# EAGLE design ESP32-S3 Parallel TFT with Touch 4.3“ V3.1 (EAGLE 6.1)
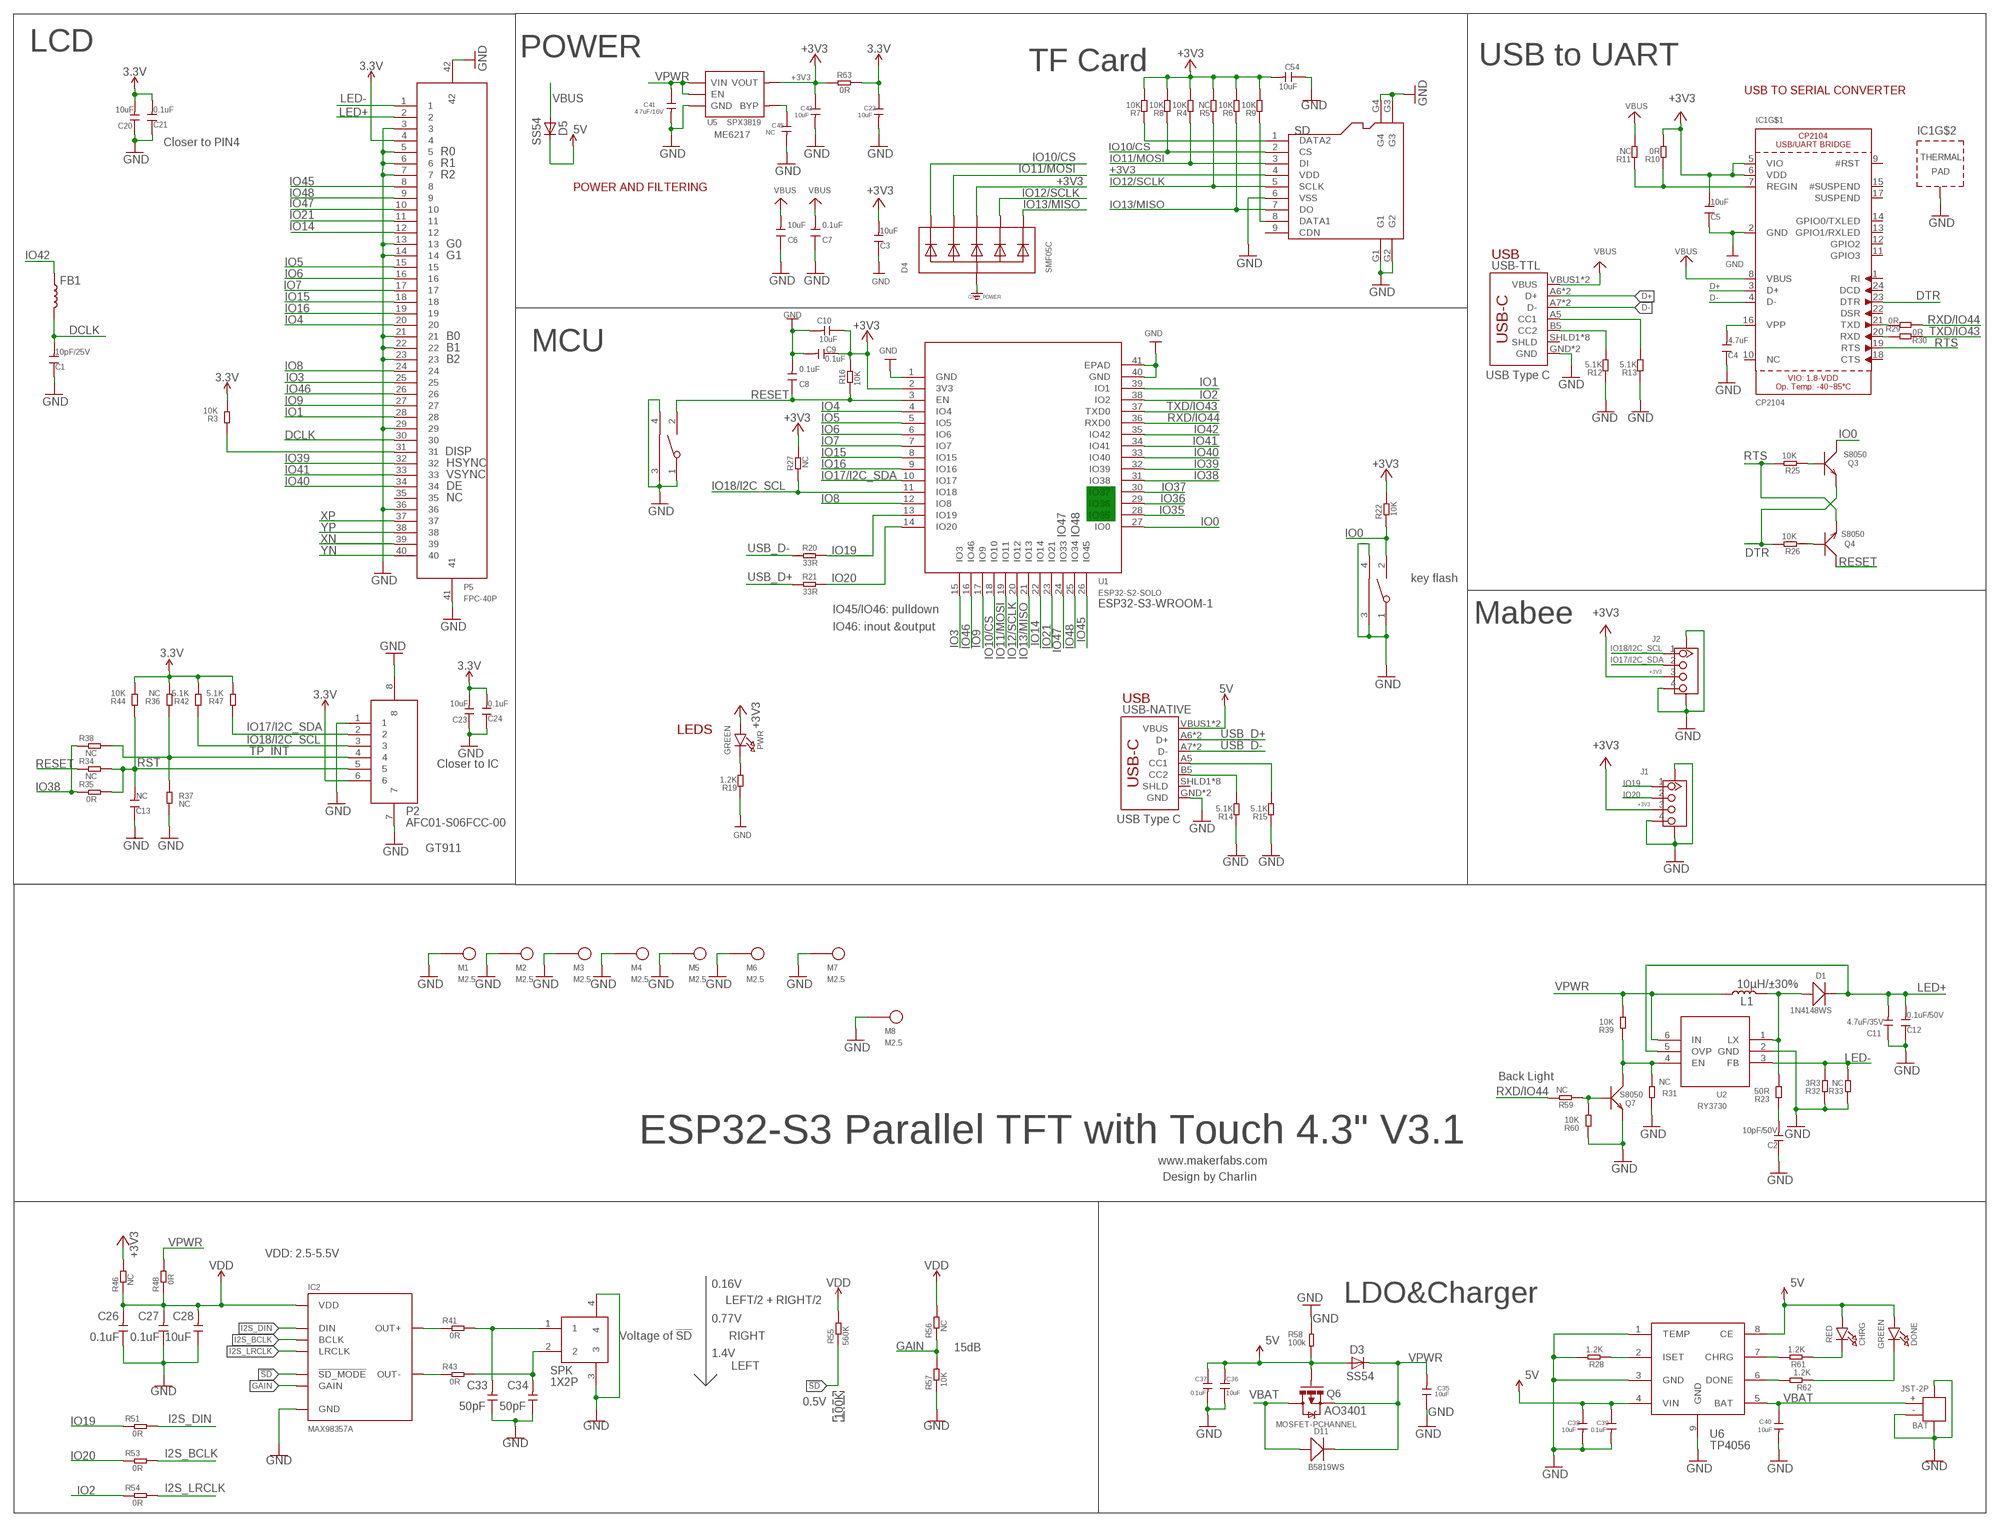
[diagram p0: schematic, sheet 1]

## Parts
BAT  JST-2P  JST-2P-SMD'2.0'  [HW2-SMD-2.0-90D]
BOOT  TS24CA  [2*4*3.5MM]
C1  10pF/25V  DISCRETE_C-0603  [DISCRETE_C0603]
C2  10pF/50V  DISCRETE_C-0603  [DISCRETE_C0603]
C3  10uF  DISCRETE_C-0603  [DISCRETE_C0603]
C4  4.7uF  DISCRETE_C-0603  [DISCRETE_C0603]
C5  10uF  DISCRETE_C-0603  [DISCRETE_C0603]
C6  10uF  DISCRETE_C-0603  [DISCRETE_C0603]
C7  0.1uF  DISCRETE_C-0603  [DISCRETE_C0603]
C8  0.1uF  DISCRETE_C-0603  [DISCRETE_C0603]
C9  0.1uF  DISCRETE_C-0603  [DISCRETE_C0603]
C10  10uF  DISCRETE_C-0603  [DISCRETE_C0603]
C11  4.7uF/35V  DISCRETE_C-1206  [DISCRETE_C1206]
C12  0.1uF/50V  DISCRETE_C-0603  [DISCRETE_C0603]
C13  NC  DISCRETE_C-0603  [DISCRETE_C0603]
C20  10uF  DISCRETE_C-0603  [DISCRETE_C0603]
C21  0.1uF  DISCRETE_C-0603  [DISCRETE_C0603]
C22  10uF  C-0603  [0603]
C23  10uF  DISCRETE_C-0603  [DISCRETE_C0603]
C24  0.1uF  DISCRETE_C-0603  [DISCRETE_C0603]
C26  0.1uF  C-0603  [0603]
C27  0.1uF  C-0603  [0603]
C28  10uF  C-0603  [0603]
C33  50pF  C-0603  [0603]
C34  50pF  C-0603  [0603]
C35  10uF  C-0603  [0603]
C36  10uF  C-0603  [0603]
C37  0.1uF  C-0603  [0603]
C38  10uF  C-0603  [0603]
C39  0.1uF  C-0603  [0603]
C40  10uF  C-0603  [0603]
C41  4.7uF/16V  C-0603  [0603]
C42  10uF  C-0603  [0603]
C45  NC  C-0603  [0603]
C54  10uF  DISCRETE_C-0603  [DISCRETE_C0603]
CHRG  RED  LED0805_NOOUTLINE  [CHIPLED_0805_NOOUTLINE]
D1  1N4148WS  D'0805'  [SOD323]
D3  SS54  DIODE-DO-214AC  [DO-214AC]
D4  SMF05C  TVSARRAY_5LANE  [SOT363]
D5  SS54  DIODE-DO-214AC  [DO-214AC]
D11  B5819WS  D'0805'  [SOD323]
DONE  GREEN  LED0805_NOOUTLINE  [CHIPLED_0805_NOOUTLINE]
FB1  INDUCTORFB-30OHM  [0603]
IC1  CP2104  [QFN24_4MM_SMSC]
IC2  MAX98357A  [TQFN-16]
J1  GROVE-CONNECTOR-SMD'90D'  [HW4-SMD-2.0-90D]
J2  GROVE-CONNECTOR-SMD'90D'  [HW4-SMD-2.0-90D]
L1  10µH/±30%  INDUCTOR-CR54-3.3UH  [CR54]
M1  M2.5  [M2.5]
M2  M2.5  [M2.5]
M3  M2.5  [M2.5]
M4  M2.5  [M2.5]
M5  M2.5  [M2.5]
M6  M2.5  [M2.5]
M7  M2.5  [M2.5]
M8  M2.5  [M2.5]
P2  AFC01-S06FCC-00  [SMD8-50P-740L535W]
P5  FPC-40P  [SMD42-50P-2560L490W]
PWR  GREEN  LED0805_NOOUTLINE  [CHIPLED_0805_NOOUTLINE]
Q3  S8050  TRANSISTOR-NPN-SOT23  [SOT23]
Q4  S8050  TRANSISTOR-NPN-SOT23  [SOT23]
Q6  MOSFET-PCHANNEL  [SOT23-3]
Q7  S8050  TRANSISTOR-NPN-SOT23  [SOT23]
R3  10K  DISCRETE_R-0603  [DISCRETE_R0603]
R4  10K  DISCRETE_R-0603  [DISCRETE_R0603]
R5  NC  DISCRETE_R-0603  [DISCRETE_R0603]
R6  10K  DISCRETE_R-0603  [DISCRETE_R0603]
R7  10K  DISCRETE_R-0603  [DISCRETE_R0603]
R8  10K  DISCRETE_R-0603  [DISCRETE_R0603]
R9  10K  DISCRETE_R-0603  [DISCRETE_R0603]
R10  0R  DISCRETE_R-0603  [DISCRETE_R0603]
R11  NC  DISCRETE_R-0603  [DISCRETE_R0603]
R12  5.1K  DISCRETE_R-0603  [DISCRETE_R0603]
R13  5.1K  DISCRETE_R-0603  [DISCRETE_R0603]
R14  5.1K  DISCRETE_R-0603  [DISCRETE_R0603]
R15  5.1K  DISCRETE_R-0603  [DISCRETE_R0603]
R16  10K  R-0603  [R0603]
R19  1.2K  DISCRETE_R-0603  [DISCRETE_R0603]
R20  33R  R-0603  [R0603]
R21  33R  R-0603  [R0603]
R22  10K  R-0603  [R0603]
R23  50R  DISCRETE_R-0603  [DISCRETE_R0603]
R25  10K  R-0603  [R0603]
R26  10K  R-0603  [R0603]
R27  NC  R-0603  [R0603]
R28  1.2K  R-0603  [R0603]
R29  0R  R-0603  [R0603]
R30  0R  R-0603  [R0603]
R31  NC  DISCRETE_R-0603  [DISCRETE_R0603]
R32  3R3  DISCRETE_R-0603  [DISCRETE_R0603]
R33  NC  DISCRETE_R-0603  [DISCRETE_R0603]
R34  NC  R-0603  [R0603]
R35  0R  R-0603  [R0603]
R36  NC  DISCRETE_R-0603  [DISCRETE_R0603]
R37  NC  DISCRETE_R-0603  [DISCRETE_R0603]
R38  NC  R-0603  [R0603]
R39  10K  DISCRETE_R-0603  [DISCRETE_R0603]
R41  0R  R-0603  [R0603]
R42  5.1K  DISCRETE_R-0603  [DISCRETE_R0603]
R43  0R  R-0603  [R0603]
R44  10K  DISCRETE_R-0603  [DISCRETE_R0603]
R46  NC  R-0603  [R0603]
R47  5.1K  DISCRETE_R-0603  [DISCRETE_R0603]
R48  0R  R-0603  [R0603]
R51  0R  R-0603  [R0603]
R53  0R  R-0603  [R0603]
R54  0R  R-0603  [R0603]
R55  560K  R-0603  [R0603]
R56  NC  R-0603  [R0603]
R57  10K  R-0603  [R0603]
R58  100k  R-0603  [R0603]
R59  NC  DISCRETE_R-0603  [DISCRETE_R0603]
R60  10K  DISCRETE_R-0603  [DISCRETE_R0603]
R61  1.2K  R-0603  [R0603]
R62  1.2K  R-0603  [R0603]
R63  0R  R-0603  [R0603]
RST  TS24CA  [2*4*3.5MM]
SD  HOLDER-MICROSD-9P  [9P-SMD-W/-RING]
SPK  1X2P  [1X2P-SMT1.25MM]
U1  ESP32­S2­SOLO  [ESP32-­S2-­SOLO]
U2  RY3730  [SOT23-6]
U5  SPX3819  [SOT23-5]
U6  TP4056  [SOP8-1.27P]
USB-NATIVE  USB_C5  [USB-C-16P-5]
USB-TTL  USB_C5  [USB-C-16P-5]

## Nets
3.3V: C20.2 C21.2 C22.1 C23.2 C24.2 P2.6 P5.4 R3.2 R36.2 R42.2 R44.2 R47.2 R63.2
5V: C36.2 C37.1 C38.1 C39.1 CHRG.A D3.A D5.C DONE.A Q6.1(G) R58.1 U6.4(VIN) U6.8(CE) USB-NATIVE.VBUS1(VBUS) USB-NATIVE.VBUS2(VBUS)
!SD: IC2.P$4(!SD_MODE) R55.1
+3V3: C3.2 C5.2 C9.1 C10.1 C42.1 C54.2 D4.4(C3) IC1.5(VIO) IC1.6(VDD) J1.3 J2.3 PWR.A R4.2 R5.2 R6.2 R7.2 R8.2 R9.2 R10.2 R16.2 R22.2 R27.2 R46.2 R63.1 SD.4(VDD) U1.2(3V3) U5.5(VOUT)
D+: IC1.3(D+) USB-TTL.A6(D+) USB-TTL.B6(D+)
D-: IC1.4(D-) USB-TTL.A7(D-) USB-TTL.B7(D-)
DCLK: C1.2 FB1.2 P5.30
DTR: IC1.23(DTR) Q3.2(E) R26.2
GAIN: IC2.P$2(GAIN) R56.1 R57.2
GND: BAT.3 BAT.4 BAT.- BOOT.1 BOOT.3 BOOT.4 C1.1 C2.1 C3.1 C4.1 C5.1 C6.1 C7.1 C8.2 C9.2 C10.2 C11.1 C12.1 C13.1 C20.1 C21.1 C22.2 C23.1 C24.1 C26.1 C27.1 C28.1 C33.1 C34.1 C35.1 C36.1 C37.2 C38.2 C39.2 C40.2 C41.2 C42.2 C45.2 C54.1 D4.2(A) IC1.2(GND) IC1.THERM(TP) IC2.P$3(GND) IC2.P$11(GND) IC2.P$15(GND) IC2.P$EP(GND) J1.4 J1.SS1 J1.SS2 J2.4 J2.SS1 J2.SS2 M1.1 M2.1 M3.1 M4.1 M5.1 M6.1 M7.1 M8.1 P2.1 P2.7 P2.8 P5.3 P5.5 P5.6 P5.7 P5.13 P5.14 P5.21 P5.22 P5.23 P5.29 P5.36 P5.41 P5.42 Q7.2(E) R12.1 R13.1 R14.1 R15.1 R19.1 R28.2 R31.1 R32.1 R33.1 R37.2 R57.1 R58.2 R60.1 RST.1 RST.3 RST.4 SD.6(VSS) SD.G1 SD.G2 SD.G3 SD.G4 SPK.3 SPK.4 U1.1(GND) U1.40(GND) U1.41(EPAD) U2.2(GND) U5.2(GND) U6.1(TEMP) U6.3(GND) U6.9(GND) USB-NATIVE.GND USB-NATIVE.GND2(GND) USB-TTL.GND USB-TTL.GND2(GND) ; supply symbol labelled GND_POWER
I2S_BCLK: IC2.P$16(BCLK) R53.2
I2S_DIN: IC2.P$1(DIN) R51.2
I2S_LRCLK: IC2.P$14(LRCLK) R54.2
IO0: BOOT.2 Q3.3(C) R22.1 U1.27(IO0)
IO1: P5.28 U1.39(IO1)
IO2: R54.1 U1.38(IO2)
IO3: P5.25 U1.15(IO3)
IO4: P5.20 U1.4(IO4)
IO5: P5.15 U1.5(IO5)
IO6: P5.16 U1.6(IO6)
IO7: P5.17 U1.7(IO7)
IO8: P5.24 U1.12(IO8)
IO9: P5.27 U1.17(IO9)
IO10/CS: D4.1(C1) R8.1 SD.2(CS) U1.18(IO10)
IO11/MOSI: D4.3(C2) R4.1 SD.3(DI) U1.19(IO11)
IO12/SCLK: D4.5(C4) R5.1 SD.5(SCLK) U1.20(IO12)
IO13/MISO: D4.6(C5) R6.1 SD.7(DO) U1.21(IO13)
IO14: P5.12 U1.22(IO14)
IO15: P5.18 U1.8(IO15)
IO16: P5.19 U1.9(IO16)
IO17/I2C_SDA: J2.2 P2.2 R47.1 U1.10(IO17)
IO18/I2C_SCL: J2.1 P2.3 R27.1 R42.1 U1.11(IO18)
IO19: J1.1 R20.2 R51.1 U1.13(IO19)
IO20: J1.2 R21.2 R53.1 U1.14(IO20)
IO21: P5.11 U1.23(IO21)
IO35: U1.28(IO35)
IO36: U1.29(IO36)
IO37: U1.30(IO37)
IO38: R35.1 R38.1 U1.31(IO38)
IO39: P5.32 U1.32(IO39)
IO40: P5.34 U1.33(IO40)
IO41: P5.33 U1.34(IO41)
IO42: FB1.1 U1.35(IO42)
IO45: P5.8 U1.26(IO45)
IO46: P5.26 U1.16(IO46)
IO47: P5.10 U1.24(IO33)
IO48: P5.9 U1.25(IO34)
LED+: C11.2 C12.2 D1.- P5.2 U2.5(OVP)
LED-: P5.1 R32.2 R33.2 U2.3(FB)
N$1: C4.2 IC1.16(VPP)
N$2: Q4.1(B) R26.1
N$3: Q3.1(B) R25.1
N$6: R15.2 USB-NATIVE.A5(CC1)
N$7: PWR.C R19.2
N$10: R13.2 USB-TTL.A5(CC1)
N$11: R12.2 USB-TTL.B5(CC2)
N$12: IC1.7(REGIN) R10.1 R11.1
N$14: R14.2 USB-NATIVE.B5(CC2)
N$17: D1.+ L1.P$2 R23.2 U2.1(LX)
N$18: IC1.21(TXD) R29.2
N$19: IC1.20(RXD) R30.2
N$21: IC2.P$9(OUT+) R41.1
N$22: C2.2 R23.1
N$23: IC2.P$10(OUT-) R43.1
N$24: Q7.3(C) R31.2 R39.1 U2.4(EN)
N$26: C33.2 R41.2 SPK.1
N$27: C34.2 R43.2 SPK.2
N$28: P5.31 R3.1
N$29: Q7.1(B) R59.1 R60.2
N$30: R28.1 U6.2(ISET)
N$31: R61.2 U6.7(CHRG)
N$32: R62.2 U6.6(DONE)
N$33: CHRG.C R61.1
N$34: DONE.C R62.1
N$47: R7.1 SD.1(DATA2)
N$48: R9.1 SD.8(DATA1)
N$76: C45.1 U5.4(BYP)
RESET: C8.1 Q4.3(C) R16.1 R34.1 RST.2 U1.3(EN)
RST: C13.2 P2.5 R34.2 R35.2 R44.1
RTS: IC1.19(RTS) Q4.2(E) R25.2
RXD/IO44: R29.1 R59.2 U1.36(RXD0)
TP_INT: P2.4 R36.1 R37.1 R38.2
TXD/IO43: R30.1 U1.37(TXD0)
USB_D+: R21.1 USB-NATIVE.A6(D+) USB-NATIVE.B6(D+)
USB_D-: R20.1 USB-NATIVE.A7(D-) USB-NATIVE.B7(D-)
VBAT: BAT.+ C40.1 D11.+ Q6.3(D) U6.5(BAT)
VBUS: C6.2 C7.2 D5.A IC1.8(VBUS) R11.2 USB-TTL.VBUS1(VBUS) USB-TTL.VBUS2(VBUS)
VDD: C26.2 C27.2 C28.2 IC2.P$7(VDD) IC2.P$8(VDD) R46.1 R48.1 R55.2 R56.2
VPWR: C35.2 C41.1 D3.C D11.- L1.P$1 Q6.2(S) R39.2 R48.2 U2.6(IN) U5.1(VIN) U5.3(EN)
XN: P5.39
XP: P5.37
YN: P5.40
YP: P5.38
Unconnected: IC1.1(RI) IC1.9(#RST) IC1.10(NC) IC1.11(GPIO3) IC1.12(GPIO2) IC1.13(GPIO1/RXLED) IC1.14(GPIO0/TXLED) IC1.15(#SUSPEND) IC1.17(SUSPEND) IC1.18(CTS) IC1.22(DSR) IC1.24(DCD) P5.35 SD.9(CDN) USB-NATIVE.SHLD1(SHLD) USB-NATIVE.SHLD2(SHLD) USB-NATIVE.SHLD3(SHLD) USB-NATIVE.SHLD4(SHLD) USB-NATIVE.SHLD5(SHLD) USB-NATIVE.SHLD6(SHLD) USB-NATIVE.SHLD7(SHLD) USB-NATIVE.SHLD8(SHLD) USB-TTL.SHLD1(SHLD) USB-TTL.SHLD2(SHLD) USB-TTL.SHLD3(SHLD) USB-TTL.SHLD4(SHLD) USB-TTL.SHLD5(SHLD) USB-TTL.SHLD6(SHLD) USB-TTL.SHLD7(SHLD) USB-TTL.SHLD8(SHLD)

## Notes on the sheet
- LCD | POWER
- TF Card | USB to UART
- USB TO SERIAL CONVERTER
- ME6217
- Closer to PIN4
- R0
- R1
- R2
- POWER AND FILTERING
- G0
- G1 | USB
- B0
- B1 | MCU
- B2
- USB Type C
- DISP
- HSYNC
- VSYNC
- DE
- NC
- IO47 | IO48
- key flash
- ESP32-S3-WROOM-1
- IO45/IO46: pulldown
- Mabee
- IO46: inout &output
- USB
- LEDS
- Closer to IC
- USB Type C
- GT911
- Back Light
- ESP32-S3 Parallel TFT with Touch 4.3" V3.1
- www.makerfabs.com
- Design by Charlin
- VDD: 2.5-5.5V
- 0.16V
- LEFT/2 + RIGHT/2 | LDO&Charger
- 0.77V
- Voltage of !SD | RIGHT
- 15dB
- 1.4V
- LEFT
- 0.5V
- AO3401
- 100K

## Library data of the parts
BAT = Connector-new:JST-2P-SMD: 2P-SMD-1.0-90D:320110054;2P-SMD-2.0-90D:320110026
BOOT RST = sale:TS24CA
C1-C13 C20 C21 C23 C24 C54 = A9G:DISCRETE_C*: Ceramic Capacitors
C22 C26-C28 C33-C42 C45 = Discrete:C*: Ceramic Capacitors
CHRG DONE PWR = microbuilder:LED: LED 0603 - 0603 Surface Mount Package 2mA: Green LED - Low Power (3.9mcd, 2ma, 1.7Vf) - Digikey: 475-2709-2-ND Orange LED - Low Power (9.8mcd, 2ma, 1.8Vf) - Digikey: 475-1194-2-ND Red LED - Low Power (5mcd, 2ma, 1.8Vf) - Digikey: 475-1195-2-ND Yellow LED - Low Power (7mcd, 2ma, 1.8Vf) - Digikey: 475-1196-2-ND 5mA: Blue LED - Low Power (17mcd, 5ma, 2.9Vf) - Digikey: LNJ937W8CRACT-ND 0805 - 0805 Surface Mount Package 2mA: Red LED (8.8mcd, 2mA, 1.8Vf, Clear) - Low Power [Digikey: 475-2510-1-ND] Green LED (5mcd, 2mA, 1.8Vf, Clear) - Low Power [Digikey: 475-2730-1-ND] Yellow LED (11.3mcd, 2mA, 1.8Vf, Clear) - Low Power [Digikey: 475-2555-1-ND] 20mA: Red LED (104mcd, 20mA, Diffused) - LS R976 [Digikey: 475-1278-6-ND] Red LED (12mcd, 20mA, 2.0Vf, Clear) - APT2012EC [Digikey: 754-1128-1-ND] Green LED (15mcd, 20mA, 2.2Vf, Clear) - APT2012GC [Digikey: 754-1131-1-ND] Orange LED (160mcd, 20mA, 2.1Vf, Clear) - APT2012SECK [Digikey: 754-1130-1-ND] 1206 - 1206 Surface Mount Package Green LED (26mcd, 20mA, Diffused) - LG N971 [Digikey: 475-1407-6-ND] Red LED (15mcd, 20mA, Diffused) - LH N974 [Digikey: 475-1416-6-ND] Cree - Cree High-Power Surface Mount LEDs XPEBWT-L1-0000-00D50 - White 111lm 350mA 2.9Vf 6200K 110° XTEAWT-00-0000-00000LEE3 - White 114lm 350mA 2.85Vf 5000K 115° Everlight - Everlight 45-21 Series Surface Mount LEDs 45-21/QK2C-B2832AC2CB2/2T - Warm White 2000mcd 20mA 3.25Vf 3050K 120° 45-21/LK2C-B38452C4CB2/2T - Nuetral White 2000mcd 20mA 3.25Vf 4150K 120° 45-21/LK2C-B50634C6CB2/2T - Cold White 2200mcd 20mA 3.25Vf 5650K 120° PLCC2 Reverse Mount LS T77K-J1L2-1-0-2-R18-Z - Red 11.25mcd 2mA 1.8Vf 630nm 120° LO T77K-L1M2-24-Z - Orange 19.6mcd 2mA 1.8Vf 606nm 120° LY T77K-K2M1-26-Z - Yellow 15.7mcd 2mA 1.8Vf 587nm 120°
D1 D11 = Discrete:D*
D3 D5 = diode:DIODE-: DIODE
D4 = microbuilder:TVSARRAY_5LANE: Voltage Transient Suppressor Array SOT363 SMF05C - 100W 5V: Digikey - SMF05CT1GOSCT-ND
FB1 = SparkFun-Coils:INDUCTOR: Inductors Resist changes in electrical current. Basically a coil of wire. SparkFun Products: SparkFun Load Cell Amplifier - HX711 <https://www.sparkfun.com/products/13879> IOIO-OTG - V2.2 <https://www.sparkfun.com/products/13613>; PROD_ID: NDUC-07859
IC1 = microbuilder:CP2104: CP2104 - USB to UART Bridge VDD Output: 3.45V
IC2 = SparkFun-IC-Amplifiers:MAX98357A: I2S DAC 3.2W (4-8ohm); PROD_ID: IC-14032
J1 J2 = Connector-new:GROVE-CONNECTOR-SMD: 4P-SMD-2.0:320110030;4P-SMD-2.0-90D:320110032
L1 = SparkFun-Coils:INDUCTOR: Inductors Resist changes in electrical current. Basically a coil of wire. SparkFun Products: SparkFun Load Cell Amplifier - HX711 <https://www.sparkfun.com/products/13879> IOIO-OTG - V2.2 <https://www.sparkfun.com/products/13613>; PROD_ID: NDUC-11157; VALUE: 3.3µH/±30%/3.4A
M1-M8 = sale:M2.5
P2 = self:AFC01-S06FCC-00
P5 = self:FPC-40P
Q3 Q4 Q7 = Discrete:TRANSISTOR-NPN*: NPN audion
Q6 = User-Submitted:MOSFET-PCHANNEL: Generic PMOSFET IRLML2244 - TRANS-11153 (SOT-23 -20V -4.3A) (1.Gate 2.Source 3.Drain) FQP27P06 - COM-10349 <http://www.sparkfun.com/products/10349> (TO-220 -60V -27A) (1.Gate 2.Source 3.Drain); PROD_ID: TRANS-08285
R3-R15 R19 R23 R31-R33 R36 R37 R39 R42 R44 R47 R59 R60 = A9G:DISCRETE_R*
R16 R20-R22 R25-R30 R34 R35 R38 R41 R43 R46 R48 R51 R53-R58 R61-R63 = Discrete:R*
SD = Connector:HOLDER-MICROSD-9P
SPK = sale:1X2P
U1 = self:ESP32­S2­SOLO
U2 = sale:RY3730
U5 = IC:SPX3819
U6 = self:TP4056
USB-NATIVE USB-TTL = USBC:USB_C: USB Type C 16Pin Connector Super Speed pins not available on the 16-pin purely SMD connector so this part is best for USB 2.0 implementations. D1 and D2 are tied together enabling D+/- no matter which way the cable is plugged into the connector. The two channel configuration pins (CC1/2) are exposed. These are normally connected to ground via 5.1k resistors but can be reconfigured for high current/high power applications.

## Net classes
0 default: width 0.203 mm
1 vbat: width 0.254 mm, drill 0.305 mm, clearance 0.152 mm

## Board
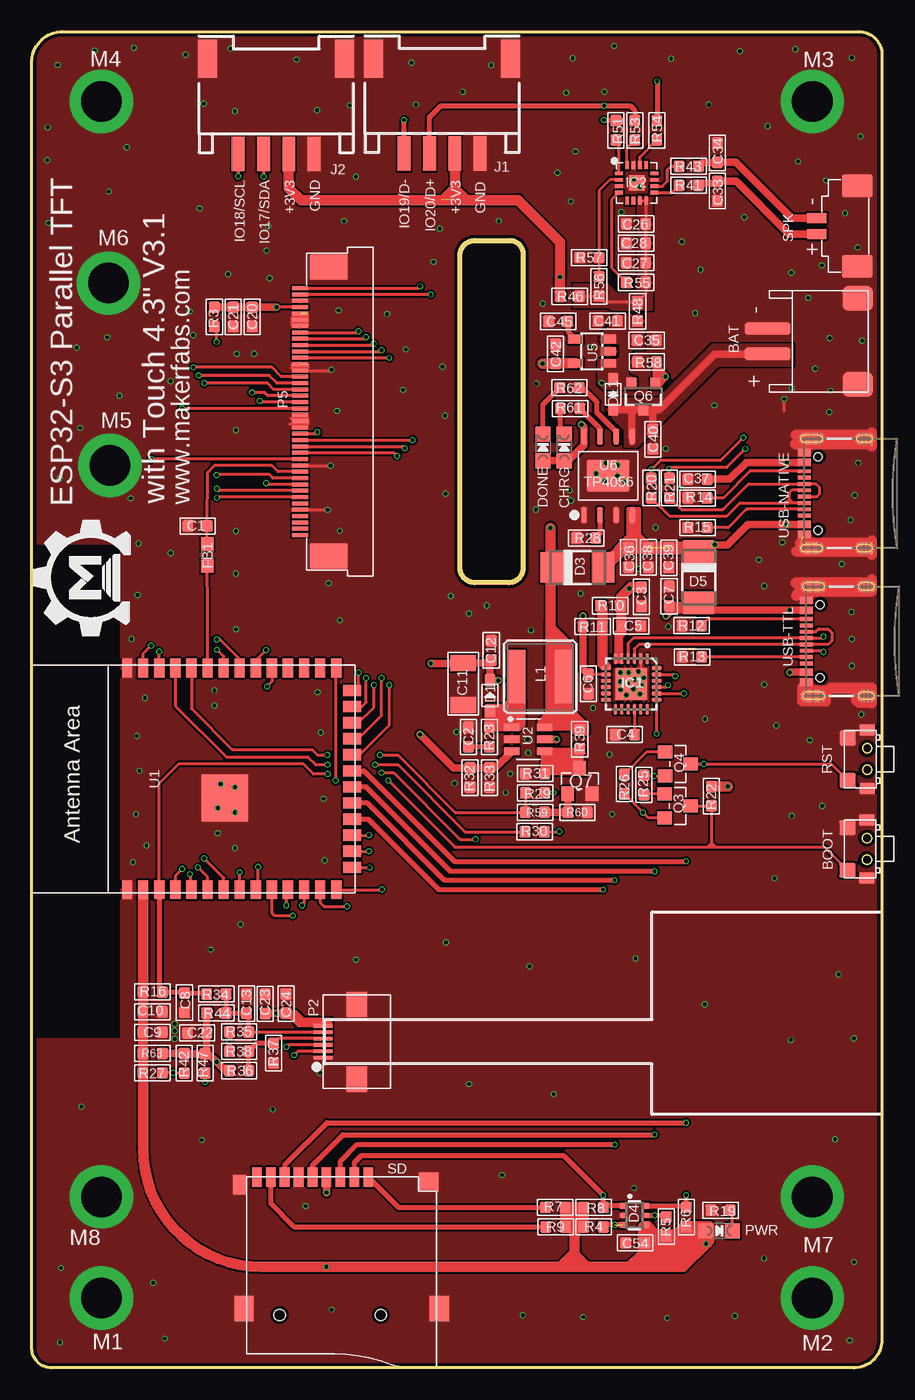
[diagram p1: board, top side]
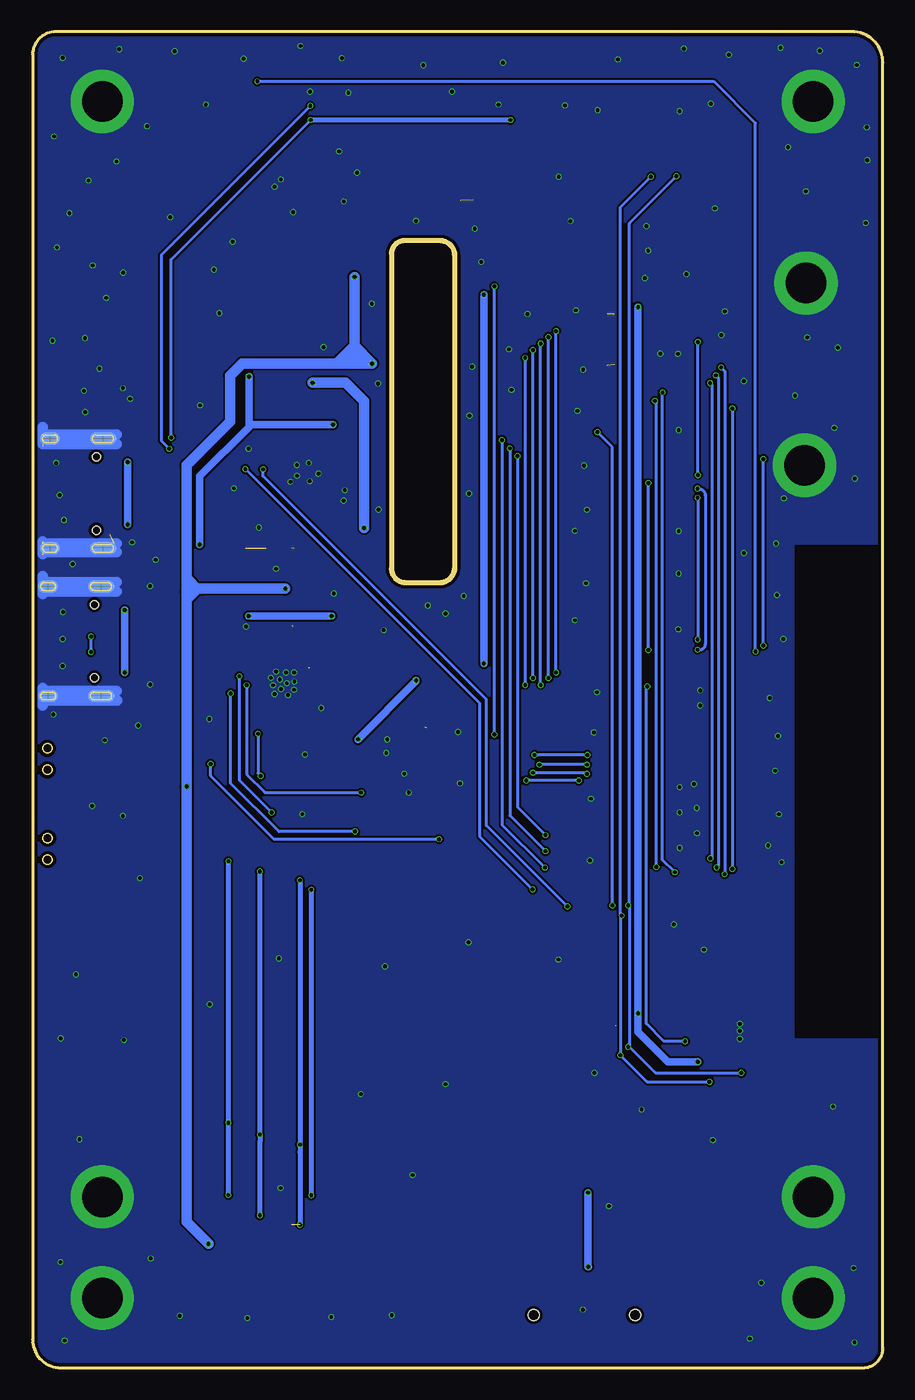
[diagram p2: board, bottom side, seen from below]

Size 67.15 x 105.5 mm. Coordinates in mm from the lower left corner, seen from the top.
Outline: 67.15,103.68 67.15,2.22 arc-90 64.93,0 1.56,0 arc-90 0,1.56 0,103.05 arc-90 2.45,105.5 65.33,105.5 arc-90 67.15,103.68
Outline: 38.81,87.96 38.81,63.14 arc-90 37.67,62 35,62 arc-90 33.81,63.2 33.81,87.82 arc-90 34.98,89 37.77,89 arc-90 38.81,87.96
Copper layers (1*16): Top 0.035mm / dielectric 1.5mm / Bottom 0.035mm
Design rules: minimum track width 6mil, minimum drill 10mil, track to track 6mil, track to pad 6mil, pad to pad 6mil, via to via 6mil, smd to smd 0mil, copper to edge 10mil, drill to drill 10mil, minimum pad ring 3mil, minimum via ring 3mil, stop-mask expansion 2mil, vias tented up to drill 100mil, thermal gap 0mil
tRestrict: area -0.1,26.1 to 6.9,65
bRestrict: area -0.1,26.1 to 6.9,65

### Footprints (pad centres in the part's own frame; a part is rotated, then mirrored left to right if it is on the bottom)
HW2-SMD-2.0-90D = smd 2 x 2.4: 3 3.4,-2.181; 4 -3.4,-2.181 | smd 1 x 3.6: + -1,4.953; - 1,4.953
2*4*3.5MM = smd 1.15 x 1.3: 1 -1.675,0; 2 1.675,0 | smd 0.9 x 1.2: 3 2.3,1.55; 4 -2.3,1.55
DISCRETE_C0603 = smd 0.889 x 0.889: 1 -0.762,0; 2 0.762,0
DISCRETE_C1206 = smd 1.27 x 2.032: 1 -1.651,0; 2 1.651,0
0603 = smd 0.889 x 0.889: 1 -0.762,0; 2 0.762,0
CHIPLED_0805_NOOUTLINE = smd 1.2 x 1.2: A 0,-1.05; C 0,1.05
SOD323 = smd 1 x 0.8: + -1.2,0; - 1.2,0
DO-214AC = smd 1.8 x 2.4: A 2.025,0; C -2.025,0
SOT363 = smd 0.5 x 0.5: 1 -0.75,-0.9; 3 0.75,-0.9; 4 0.75,0.9; 6 -0.75,0.9 | smd 0.4 x 0.5: 2 0,-0.9; 5 0,0.9
0603' = smd 1.1 x 1: 1 -0.85,0; 2 0.85,0
QFN24_4MM_SMSC = smd 0.8 x 0.28: 1 -2,1.25; 2 -2,0.75; 3 -2,0.25; 4 -2,-0.25; 5 -2,-0.75; 6 -2,-1.25; 13 2,-1.25; 14 2,-0.75; 15 2,-0.25; 16 2,0.25; 17 2,0.75; 18 2,1.25 | smd 0.28 x 0.8: 7 -1.25,-2; 8 -0.75,-2; 9 -0.25,-2; 10 0.25,-2; 11 0.75,-2; 12 1.25,-2; 19 1.25,2; 20 0.75,2; 21 0.25,2; 22 -0.25,2; 23 -0.75,2; 24 -1.25,2 | smd 2.5 x 2.5: THERM 0,0
TQFN-16 = smd 0.3 x 0.65: P$1 -0.75,-1.4; P$2 -0.25,-1.4; P$3 0.25,-1.4; P$4 0.75,-1.4; P$9 0.75,1.4; P$10 0.25,1.4; P$11 -0.25,1.4; P$12 -0.75,1.4 | smd 0.65 x 0.3: P$5 1.4,-0.75; P$6 1.4,-0.25; P$7 1.4,0.25; P$8 1.4,0.75; P$13 -1.4,0.75; P$14 -1.4,0.25; P$15 -1.4,-0.25; P$16 -1.4,-0.75 | smd 1.23 x 1.23: P$EP 0,0
HW4-SMD-2.0-90D = smd 1.01 x 2.74: 1 -3,-0.1; 2 -1,-0.1; 3 1,-0.1; 4 3,-0.1 | smd 1.5 x 3: SS1 -5.4,7.4; SS2 5.4,7.4
CR54 = smd 4.2 x 1.4: P$1 0,1.85; P$2 0,-1.85
M2.5 = drill 3.2 pad 5: 1 0,0
SMD8-50P-740L535W = smd 0.3 x 1.5: 1 -1.25,0; 2 -0.75,0; 3 -0.25,0; 4 0.25,0; 5 0.75,0; 6 1.25,0 | smd 2 x 1.6: 7 2.95,-2.68; 8 -2.95,-2.68
SMD42-50P-2560L490W = smd 0.3 x 1.3: 1 9.75,0; 2 9.25,0; 3 8.75,0; 4 8.25,0; 5 7.75,0; 6 7.25,0; 7 6.75,0; 8 6.25,0; 9 5.75,0; 10 5.25,0; 11 4.75,0; 12 4.25,0; 13 3.75,0; 14 3.25,0; 15 2.75,0; 16 2.25,0; 17 1.75,0; 18 1.25,0; 19 0.75,0; 20 0.25,0; 21 -0.25,0; 22 -0.75,0; 23 -1.25,0; 24 -1.75,0; 25 -2.25,0; 26 -2.75,0; 27 -3.25,0; 28 -3.75,0; 29 -4.25,0; 30 -4.75,0; 31 -5.25,0; 32 -5.75,0; 33 -6.25,0; 34 -6.75,0; 35 -7.25,0; 36 -7.75,0; 37 -8.25,0; 38 -8.75,0; 39 -9.25,0; 40 -9.75,0 | smd 2 x 3: 41 -11.4,-2.25; 42 11.4,-2.25
SOT23 = smd 1.016 x 1.143: 1 -0.95,-1.016; 2 0.95,-1.016; 3 0,1.016
SOT23-3 = smd 0.8 x 0.9: 1 -0.95,-1; 2 0.95,-1; 3 0,1.1
DISCRETE_R0603 = smd 0.889 x 0.889: 1 -0.762,0; 2 0.762,0
R0603 = smd 0.889 x 0.889: 1 -0.762,0; 2 0.762,0
9P-SMD-W/-RING = smd 1.524 x 0.762: 1 0,4.4; 2 0,3.3; 3 0,2.2; 4 0,1.1; 5 0,0; 6 0,-1.1; 7 0,-2.2; 8 0,-3.3; 9 0,-4.4 | smd 1.524 x 1.016: G1 0.6,-5.746 | smd 2.032 x 1.524: G2 10.373,-5.4; G3 10.373,10 | smd 1.524 x 1.524: G4 0.392,9.181 | hole 0.889: 10.9,-2.6; 10.9,5.4
1X2P-SMT1.25MM = smd 0.8 x 1.6: 1 -0.625,0; 2 0.625,0 | smd 1.8 x 2.4: 3 3.175,-3.2; 4 -3.175,-3.2
ESP32-­S2-­SOLO = smd 1.5 x 0.9: 1 -8.75,5.26; 2 -8.75,3.99; 3 -8.75,2.72; 4 -8.75,1.45; 5 -8.75,0.18; 6 -8.75,-1.09; 7 -8.75,-2.36; 8 -8.75,-3.63; 9 -8.75,-4.9; 10 -8.75,-6.17; 11 -8.75,-7.44; 12 -8.75,-8.71; 13 -8.75,-9.98; 14 -8.75,-11.25; 27 8.75,-11.25; 28 8.75,-9.98; 29 8.75,-8.71; 30 8.75,-7.44; 31 8.75,-6.17; 32 8.75,-4.9; 33 8.75,-3.63; 34 8.75,-2.36; 35 8.75,-1.09; 36 8.75,0.18; 37 8.75,1.45; 38 8.75,2.72; 39 8.75,3.99; 40 8.75,5.26 | smd 0.9 x 1.5: 15 -6.985,-12.5; 16 -5.715,-12.5; 17 -4.445,-12.5; 18 -3.175,-12.5; 19 -1.905,-12.5; 20 -0.635,-12.5; 21 0.635,-12.5; 22 1.905,-12.5; 23 3.175,-12.5; 24 4.445,-12.5; 25 5.715,-12.5; 26 6.985,-12.5 | smd 3.7 x 3.7: 41 -1.5,-2.46
SOT23-6 = smd 1.2 x 0.6: 1 -1.3,0.95; 2 -1.3,0; 3 -1.3,-0.95; 4 1.3,-0.95; 5 1.3,0; 6 1.3,0.95
SOT23-5 = smd 0.69 x 1.2: 1 -0.95,-1.3; 2 0,-1.3; 3 0.95,-1.3; 4 0.95,1.3; 5 -0.95,1.3
SOP8-1.27P = smd 1.27 x 0.51: 1 -3.1,1.905; 2 -3.1,0.635; 3 -3.1,-0.635; 4 -3.1,-1.905; 5 3.1,-1.905; 6 3.1,-0.635; 7 3.1,0.635; 8 3.1,1.905 | smd 2.5 x 3.4: 9 0,0
USB-C-16P-5 = smd 0.3 x 1: A5 -1.25,-0.34; A6 -0.25,-0.34; A7 0.25,-0.34; A8 1.25,-0.34; B5 1.75,-0.34; B6 0.75,-0.34; B7 -0.75,-0.34; B8 -1.75,-0.34 | smd 0.6 x 1: GND -3.225,-0.34; GND2 3.225,-0.34; VBUS1 -2.45,-0.34; VBUS2 2.45,-0.34 | smd 1 x 2.1: SHLD1 -4.32,-0.915; SHLD2 4.32,-0.915 | smd 1 x 2.1 bottom: SHLD3 -4.32,-0.915; SHLD4 4.32,-0.915 | smd 1 x 1.6: SHLD5 -4.32,-5.095; SHLD8 4.32,-5.095 | smd 1 x 1.6 bottom: SHLD6 -4.32,-5.095; SHLD7 4.32,-5.095 | hole 0.65: -2.89,-1.445; 2.89,-1.445

### Placement (x,y rotation side)
BAT  63.07,81.05 90 top
BOOT  64.41,40.97 270 top
C1  13.11,66.47 0 top
C2  34.49,49.81 270 top
C3  48.16,60.88 90 top
C4  46.84,50 0 top
C5  47.35,58.57 180 top
C6  43.97,54 90 top
C7  50.34,60.93 270 top
C8  12.06,28.83 270 top
C9  9.55,26.49 0 top
C10  9.55,28.12 0 top
C11  34.09,54 90 top
C12  36.3,56.64 270 top
C13  16.97,28.75 270 top
C20  17.42,82.98 90 top
C21  15.92,82.98 90 top
C22  13.07,26.43 180 top
C23  18.45,28.73 270 top
C24  20.09,28.75 270 top
C26  47.73,90.32 0 top
C27  47.73,87.25 0 top
C28  47.73,88.8 0 top
C33  54.15,92.91 90 top
C34  54.15,95.94 270 top
C35  48.56,81.13 180 top
C36  47.14,63.98 90 top
C37  52.58,70.15 180 top
C38  48.72,63.98 270 top
C39  50.32,63.96 270 top
C40  49.05,73.3 270 top
C41  45.49,82.65 180 top
C42  41.38,80.06 90 top
C45  41.58,82.63 180 top
C54  47.67,9.87 0 top
CHRG  42.06,72.67 0 top
D1  36.2,53.09 90 top
D3  43.1,63.2 0 top
D4  47.6,12.04 270 top
D5  52.68,62.43 270 top
D11  45.92,76.86 90 top
DONE  40.39,72.67 0 top
FB1  [0603']  13.87,64.19 90 top
IC1  47.35,54 270 top
IC2  47.78,93.55 270 top
J1  32.41,95.97 0 top
J2  19.31,95.95 0 top
L1  40.16,54.56 270 top
M1  5.5,5.5 0 top
M2  61.65,5.5 0 top
M3  61.65,100 0 top
M4  5.5,100 0 top
M5  6.19,71.25 0 top
M6  6.07,85.65 0 top
M7  61.65,13.5 0 top
M8  5.5,13.5 0 top
P2  23,25.75 90 top
P5  21.2,75.5 90 top
PWR  54.3,10.82 270 top
Q3  51.02,44.37 270 top
Q4  51.03,47.68 270 top
Q6  48.31,76.73 180 top
Q7  43.28,46.33 0 top
R3  14.43,82.98 90 top
R4  44.37,11.13 180 top
R5  50.11,11.15 270 top
R6  51.69,11.91 270 top
R7  41.35,12.67 0 top
R8  44.37,12.67 180 top
R9  41.38,11.13 0 top
R10  45.69,60.17 0 top
R11  44.3,58.55 180 top
R12  52.12,58.6 0 top
R13  52.15,56.13 0 top
R14  52.58,68.68 0 top
R15  52.58,66.34 0 top
R16  9.55,29.67 180 top
R19  54.41,12.45 0 top
R20  48.92,69.47 90 top
R21  50.37,69.47 90 top
R22  53.69,45.13 90 top
R23  36.14,49.81 90 top
R25  48.36,46.02 90 top
R26  46.8,46.1 270 top
R27  9.55,23.29 180 top
R28  43.79,65.53 180 top
R29  39.76,45.4 0 top
R30  39.72,42.33 0 top
R31  39.75,46.91 0 top
R32  34.62,46.61 90 top
R33  36.17,46.61 90 top
R34  14.58,29.51 0 top
R35  16.38,26.52 0 top
R36  16.38,23.47 180 top
R37  19.1,24.84 270 top
R38  16.38,24.99 0 top
R39  43.28,49.63 90 top
R41  51.89,93.37 0 top
R42  12.06,24.05 90 top
R43  51.89,94.87 0 top
R44  14.58,28.01 180 top
R46  42.49,84.6 180 top
R47  13.7,24.05 90 top
R48  47.85,83.41 270 top
R51  46.15,97.71 270 top
R53  47.62,97.71 270 top
R54  49.38,97.71 270 top
R55  47.73,85.7 0 top
R56  44.81,85.39 270 top
R57  44.04,87.66 0 top
R58  48.59,79.43 180 top
R59  39.75,43.87 180 top
R60  43.1,43.87 180 top
R61  42.52,75.74 0 top
R62  42.47,77.39 0 top
R63  9.55,24.82 0 top
RST  64.44,48.06 270 top
SD  22.18,15.06 270 top
SPK  62,90.14 90 top
U1  12.8,46.5 90 top
U2  39.22,49.63 0 top
U5  44.25,80.26 90 top
U6  45.52,70.43 90 top
U$1  [MAKERFABS_0.3]  7.74,58.27 90 top
USB-NATIVE  60.68,69.04 90 top
USB-TTL  60.83,57.37 90 top

### Tracks (layer width: path | path; a pad name or v marks a point on that pad's centre or on a via)
3.3V  (via drill 0.3)  (1 unrouted)
  Top 0.254: P2.6 21.08,27 C24.2 20.08,27.98 v19.33,27.98 | 23.62,27 21.11,27 19.96,28.14 20.88,28.14 21.49,27.53 23.62,27.53 23.62,27.2 | 23.62,27.1 23.62,27.2 | 23.62,27.2 23.55,27.28 | P5.4 v19.34,83.75 v19.33,83.74
  Top 0.406: 23.55,27.28 21.21,27.28 20.52,27.96 20.83,27.96 21.41,27.38
  Top 0.61: R36.2 15.29,23.47 v14.61,24.16 13.95,24.81 | 13.95,24.81 R47.2 R42.2 R63.2 | 13.95,24.81 13.83,24.93 C22.1 R44.2 | C23.2 20.07,27.97 C24.2 | v19.33,83.74 C20.2 C21.2 R3.2
  Bottom 0.61: v19.33,83.74 v19.33,27.98 19.33,26.52 16.97,24.16 v14.61,24.16
5V  (via drill 0.3)  (2 unrouted)
  Top 0.254: 54,64.95 v53.95,65 53.9,64.95 | 49.35,78.99 R58.1
  Top 0.406: 42.1,71.65 CHRG.A | 47.68,67.77 47.14,67.77 47.14,65.63 46.18,64.67 46.48,64.67 47.12,65.3 | 47.68,67.77 47.93,67.77 47.93,65.76 48.64,65.05 48.21,65.05 47.68,65.58 47.68,67.77
  Top 0.61: USB-NATIVE.VBUS1 v59.64,66.59 56.55,66.59 54.92,64.95 54,64.95 | USB-NATIVE.VBUS2 59.68,71.49 | 59.68,71.49 v59.64,71.53 | 49.35,78.99 49.35,78.31 | 49.35,78.31 49.35,77.83 Q6.1 | v50.06,78.26 49.4,78.26 49.35,78.31 | v43.41,74.47 43.61,74.27 U6.8 43.61,72.85 42.38,71.62 CHRG.A DONE.A | C37.1 55.09,70.16 56.42,71.49 59.68,71.49 | U6.4 47.42,65.02 C36.2 | v50.06,78.26 49.4,78.92 49.4,77.6 v50.06,78.26 | 53.9,64.95 46.89,64.95 45.55,63.62 D3.A | C38.1 52.39,64.75 D5.C
  Top 1.016: 45.55,63.62 46.68,64.75 C36.2 C38.1 52.53,64.75 52.73,64.54
  Bottom 0.61: v59.64,71.53 v59.64,66.59 | v53.95,65 53.95,70.41 50.06,74.3 | v43.41,74.47 49.89,74.47 50.06,74.3 | v50.06,78.26 50.06,74.3
!SD
  Top 0.254: IC2.P$4 45.8,92.22 45.8,86.87 R55.1
+3V3  (via drill 0.3)  (2 unrouted)
  Top 0.254: D4.4 48.5,10.39 | 48.5,10.39 48.5,9.94 C54.2 | 48.5,10.39 R5.2 51.71,10.39 | 51.71,10.39 52.82,10.39 PWR.A | R6.2 51.69,10.41 51.71,10.39 | IC1.5 IC1.6 46.1,58.09 C5.2 | 46.1,55.73 46.61,55.73 46.61,57.71 46.89,57.99 46.89,58.83 46.66,58.6 46.66,58.09 46.41,57.84 46.41,55.88 46.28,55.88 46.28,57.99 46.48,58.19
  Top 0.406: 51.66,11.18 51.46,11.38 50.83,10.74 49.38,10.74 48.77,11.35 48.34,11.35 48.16,11.18 48.51,11.18 48.74,10.95
  Top 0.61: SD.4 v23.28,13.84 arc-90 v23.28,13.84 | 32.16,92.25 32.38,92.25 33.4,93.27 34.44,92.23
  Top 0.813: U1.2 8.81,29.69 R16.2 C10.1 C9.1 R63.1 R27.2 8.79,17.3 arc90 18.11,7.98 v23.27,7.98 41.81,7.98 | 42.98,7.98 43.87,7.98 | 43.87,7.98 47.22,7.98 | v53.26,9.8 53.26,10.8 PWR.A | J2.3 20.31,93.15 21.26,92.2 33.38,92.2 | 33.38,92.2 38.41,92.2 41.73,88.88 v41.73,86.13 R46.2 | J1.3 33.41,92.24 33.38,92.2 | R22.2 v54.98,45.89 v54.99,45.9 | U5.5 41.39,79.31 C42.1 v40.34,79.3 | v53.26,9.8 51.44,7.98 47.22,7.98 | 42.85,11 42.85,11.12 R9.2 42.11,11.15 R7.2 R8.2 R4.2 | 42.85,9.07 42.85,8.1 42.98,7.98 | 42.16,12.06 43.38,12.06 43.38,11.53 43.36,11.51 42.34,11.51 42.85,11 | 42.85,11 42.85,9.07 | 42.85,9.07 41.78,8 41.81,7.98 | 41.81,7.98 42.98,7.98 | 43.87,7.98 42.82,9.02 | 48.26,11.15 48.26,9.02 47.22,7.98 | v53.26,9.8 53.52,10.06 53.52,11.18 51.66,11.18 | C5.2 46.58,60.22 | 46.58,60.22 46.58,60.91 v47.19,61.52 47.32,61.65 C3.2 | R10.2 46.53,60.17 46.58,60.22
  Top 1.016: 48.74,10.95 48.74,8.87 48.44,8.56 51.03,8.56 52.55,10.08 52.55,10.59 51.84,10.59 50.65,9.4 49.45,9.4 49.43,9.37 49.43,10.21 49.4,10.24 50.93,10.24 51.23,10.54
  Bottom 0.61: v23.28,13.84 v23.28,7.99 arc-90 v23.27,7.98 | 53.72,61.52 53.98,61.52 54.91,60.58 54.91,62.43 | 54.91,62.76 54.91,62.43 | 54.91,62.43 53.95,61.47
  Bottom 0.813: 54.99,61.27 54.99,71.3 51.56,74.73 51.56,78.36 50.62,79.3 43.16,79.3 | 54.99,61.27 v54.99,45.9 54.99,11.53 v53.26,9.8 | v47.19,61.52 53.72,61.52 54.74,61.52 54.99,61.27 | 41.88,79.3 v40.34,79.3 41.73,80.7 | 41.88,79.3 43.16,79.3 | v41.73,86.13 41.73,80.72 | 41.73,80.7 41.73,79.45 41.88,79.3 | 41.73,80.7 41.73,80.72 | 41.73,80.72 42.8,79.65 | 43.16,79.3 42.8,79.65 | 42.8,79.65 41.07,79.65
D+
  Top 0.254: USB-TTL.B6 61.93,58.12 62.15,58.34 62.87,58.34 63.17,58.04 63.17,57.38 62.92,57.12 USB-TTL.A6 47.95,57.12 47.6,56.77 IC1.3
D-  (via drill 0.3)
  Top 0.254: USB-TTL.B7 62.43,56.62 v62.53,56.52 | v62.53,57.73 62.43,57.63 61.18,57.63 USB-TTL.A7 47.54,57.62 47.1,57.19 IC1.4
  Bottom 0.254: v62.53,56.52 v62.53,57.73
DCLK
  Top 0.254: FB1.2 C1.2 13.89,70.69 14.43,71.22 18.97,71.22 19.45,70.75 P5.30
DTR  (via drill 0.3)
  Top 0.254: Q3.2 48.71,43.42 v48.28,43.86 R26.2 | IC1.23 50.67,54.75 v50.83,54.6
  Bottom 0.254: v50.83,54.6 50.83,46.41 v48.28,43.86
GAIN
  Top 0.254: IC2.P$2 45.66,93.8 44.81,92.94 R57.2 R56.1
GND  (via drill 0.3)  (11 unrouted)
  Top 0.254: P5.14 23.61,78.75 v23.67,78.82 | P5.29 v23.59,71.25 v23.6,71.25 | P5.36 v23.36,67.75 v23.37,67.74 | 20.62,83.24 21.74,83.24 21.74,82.25 20.62,82.25 20.62,82.98 21.69,82.98 21.69,82.5 20.5,82.5 | 20.55,79.17 21.79,79.17 21.79,78.94 20.5,78.94 | 20.47,74.98 21.79,74.98 21.79,74.5 20.4,74.5 | USB-NATIVE.GND2 60.66,72.26 | 59.44,75.56 v59.44,76.5 | IC1.2 48.1,55.29
  Top 0.406: 63.2,53.7 60.86,53.7
  Top 0.813: 60.86,53.7 60.86,52.65 62.69,52.65 62.71,52.63 62.71,53.29 63.09,53.67 66.34,53.67 66.34,52.5 66.32,52.53 65.3,52.53 65.13,52.7 65.13,53.44 | 60.38,60.98 60.68,61.29 66.32,61.29 66.34,61.32 66.34,62 | 66.34,62.23 66.34,62 | 66.34,62 60.38,62 60.35,61.98 | 60.71,65.13 66.34,65.13 | 66.34,64.47 60.4,64.47 | 66.34,64.21 66.34,65.3 | 66.34,72.95 60.33,72.95 | 66.34,73.64 60.35,73.64 | 66.34,72.77 66.34,73.86
  Bottom 0.813: 60.5,72.92 66.34,72.92 66.34,73.69 | 66.34,73.69 66.34,74.3 | 60.5,73.69 66.34,73.69 | 60.5,65.1 66.34,65.1 | 60.5,64.41 66.34,64.41 | 66.34,64.26 66.34,65.25 | 60.5,62.05 66.34,62.05 | 60.5,61.29 66.34,61.29 | 66.34,61.11 66.34,62.51 | 66.34,52.3 66.34,53.44 | 66.34,53.44 66.34,53.7 | 60.5,53.44 66.34,53.44 | 60.48,52.68 66.32,52.68
  other vias: 47.93,54.97 65.51,51.59 46.96,53.11 48.03,53.21 48.34,54.48 48.16,53.9 47.14,54.89 46.51,54.89 46.48,54.18 46.51,53.54 47.07,54.05 47.52,53.59 47.62,54.36 61.44,49.56 60.02,43.59 14.43,52.3 50.19,3.94 14.43,53.49 38.79,4.14 62.43,44.37 58.8,50.72 34.54,59.56 64.74,59.66 64.77,57.56 58.67,38.66 45.64,48.44 63.98,63.47 39.83,67.77 52.4,83.29 64.77,103.43 64.62,2.16 42.57,92.1 18.54,88.21 51.26,69.44 62.99,75.46 64.67,66.93 63.09,77.14 53.47,99.75 18.8,86.03 36.88,90.55 62.74,93.75 55.93,103.96 25.63,32.23 30.35,99.75 42.21,100.69 55.52,4.11 63.45,18.03 60.3,104.11 65.46,97.23 13.59,99.82 2.06,102.87 1.22,95.35 37.13,15.21 30,103.05 12.17,103.68 7.49,96.37 1.27,97.94 59.99,86.46 60.53,95.25 13.26,91.54 4.98,103.99 15.52,86.36 5.97,81.36 3.56,80.54 18.67,90.14 3.84,74.22 65.58,81.1 58.12,98.04 61.34,84.48 62.41,87.05 8.08,104.24 45.24,100.76 57.84,8.64 46,104.37 44.35,52.1 24.33,66.09 16.51,35 32.64,75.18 16.13,74.04 42.6,68.48 2.24,2.01 2.31,7.87 10.52,2.31 3.94,20.62 9.07,41.25 8.51,47.14 14.68,42.21 16.05,41.05 8,39.93 8.23,43.71 14.94,46.1 9.6,6.71 8.94,52.88 16.13,62.71 23.7,4.6 14.71,44.2 16.13,66.07 2.21,70.21 8.43,65.07 7.87,57.56 6.93,76.76 22.78,23.29 8.31,49.89 57.86,61.72 64.77,55.42 23.44,61.95 12.47,83.41 41.22,21.62 24.33,59.03 10.97,64.34 47.55,93.83 32.23,89.94 32.44,79.04 64.24,91.16 34.54,22.4 19.05,20.4 32.72,33.58 64.92,26.01 35.94,60.2 49.28,66.34 47.93,63.09 64.95,8.36 29.34,77.22 10.97,77.9 24.13,75.56 17.58,80.09 12.75,81.53 47.57,14.2 44.17,80.59 14.15,33.02 24.66,90.55 50.5,103.35 16.05,43.84 16.05,45.85 23.14,40.06 39.32,31.7 63.02,81.31 1.35,90.4 21.64,12.78 8.38,61.01 22.58,53.34 13.44,17.98 33.55,50.22 33.4,46.15 37.8,46.91 39.42,58.24 47.7,32.33 36.3,102.84 16.05,99.21 41.53,94.36 59.28,65.18 57.86,53.95 42.72,103.4 15.72,104.17 45.85,43.71 42.95,96.04 20.93,103.3 59.94,25.88 40.36,84.02 43.56,4.01 50.29,58.52 52.83,86.72 65.23,88.47 48.03,93.27 6.1,92.89 61.87,78.89 56.29,90.86 53.16,28.7 16.18,80.06 24.23,83.49 28.07,83.21 46.58,91.24 25.6,94.06 34.04,100.76 33.1,60.93 37.44,45.42 16.15,58.32 7.82,68.66 32.69,69.04 29.54,80.42 25.12,99.67 22.53,99.29 57.43,63.8 51.36,88.93 31.72,87.33 60.02,77.34 63.73,31.06 39.14,49.61 39.22,48.54 23.06,44.93 22.83,50.16 53.19,51.23 42.49,69.29 43.36,61.14 65,68.91 39.88,77.72 46.28,71.27 45.34,71.45 50.09,72.57 45.26,70 46.25,70.43 46.79,69.95 65.28,71.45 44.58,70.61 53.92,76 11.3,26.59 11.3,25.98 11.3,27.15
  pour Top (rank 6): -13.03,117.63 71.98,117.63 71.98,-3.4 -13.03,-3.4
  pour Bottom (rank 6): -10.44,115.47 70.18,115.47 70.18,-1.52 -10.44,-1.52
I2S_BCLK
  Top 0.254: IC2.P$16 47.03,96.35 R53.2
I2S_DIN
  Top 0.254: IC2.P$1 46.38,96.73 R51.2
I2S_LRCLK
  Top 0.254: IC2.P$14 48.03,95.6 R54.2
IO0  (via drill 0.3)
  Top 0.254: v28.17,46.38 33.43,41.12 53.37,41.12 | U1.27 24,55.2 v24,46.38 | 53.37,41.12 53.7,41.12 | 53.7,41.12 54.03,41.12 | 54.03,41.12 62.59,41.12 BOOT.2 | Q3.3 R22.1 53.69,41.13 53.7,41.12 | 53.37,41.12 53.67,41.43 53.72,41.43 54.03,41.12
  Bottom 0.254: v24,46.38 v28.17,46.38
IO1  (via drill 0.3)
  Top 0.254: P5.28 v9.43,71.75 | U1.39 8.81,56.4 v9.43,57.02
  Bottom 0.254: v9.43,57.02 v9.43,71.75
IO2  (via drill 0.3)
  Top 0.254: U1.38 10.08,56.54 v10.06,56.57
  Top 0.406: v49.4,101.58 49.4,98.5 R54.1
  Bottom 0.254: v10.06,56.57 10.06,98.27 13.36,101.58 v49.4,101.58
IO3  (via drill 0.3)
  Top 0.254: U1.15 26.68,39.52 v26.7,39.5 | P5.25 v30.07,73.25
  Bottom 0.254: v30.07,73.25 30.07,42.88 v26.7,39.5
IO4  (via drill 0.3)
  Top 0.254: P5.20 v11.89,75.75 | U1.4 11.38,37.78 11.38,38.89 v11.89,39.4
  Bottom 0.254: v11.89,75.75 11.89,39.78 v11.89,39.4
IO5  (via drill 0.3)
  Top 0.254: v12.78,78.99 18.97,78.99 19.72,78.25 P5.15 | v12.5,38.98 12.5,37.88 U1.5
  Bottom 0.254: v12.78,78.99 12.5,78.72 v12.5,38.98
IO6  (via drill 0.3)
  Top 0.254: P5.16 19.38,77.75 18.77,78.36 v13.18,78.36 | U1.6 13.89,38.74 v13.13,39.5
  Bottom 0.254: v13.18,78.36 13.01,78.18 13.01,39.63 v13.13,39.5
IO7  (via drill 0.3)
  Top 0.254: U1.7 15.16,38.69 v13.63,40.23 | P5.17 19.12,77.25 18.62,77.75 v13.64,77.75
  Bottom 0.254: v13.64,77.75 13.51,77.62 13.51,40.34 v13.63,40.23
IO8  (via drill 0.3)
  Top 0.254: P5.24 22.42,73.75 v22.55,73.89 | U1.12 21.51,36.65 v21.36,36.5
  Bottom 0.254: v21.36,36.5 21.36,72.69 v22.55,73.89
IO9  (via drill 0.3)
  Top 0.254: U1.17 v26.64,42.05 v26.64,42.06 | P5.27 28.6,72.25 v28.85,72
  Bottom 0.254: v28.85,72 28.85,44.27 v26.64,42.06
IO10/CS  (via drill 0.3)
  Top 0.254: 45.26,12.79 R8.1
  Top 0.406: U1.18 26.58,43.33 32.15,37.75 v45.14,37.75 | D4.1 45.26,12.79 | R8.1 v45.14,13.61 41.99,16.76 26.04,16.76 25.48,16.21 SD.2
  Bottom 0.406: v45.14,13.61 v45.14,37.75
IO11/MOSI  (via drill 0.3)  (1 unrouted)
  Top 0.254: 45.31,11.29 R4.1
  Top 0.406: U1.19 26.52,44.59 32.62,38.5 v46.04,38.5 | D4.3 45.31,11.29 | SD.3 24.38,16.3 25.7,17.63 v46.04,17.63
  Bottom 0.406: v46.04,38.5 v46.04,17.63 46.04,17.04 v46.04,11.3
IO12/SCLK  (via drill 0.3)
  Top 0.254: 49.98,12.04 R5.1 | D4.5 v49.19,12.04 v49.2,12.04
  Top 0.406: U1.20 26.41,45.87 33.08,39.2 v49.2,39.2 | D4.5 49.98,12.04 | SD.5 22.18,16.01 24.59,18.41 v49.2,18.41
  Bottom 0.406: v49.2,12.04 49.2,17.88 v49.2,18.41 v49.2,39.2
IO13/MISO  (via drill 0.3)
  Top 0.406: U1.21 26.25,47.13 33.38,40 v51.69,40 | SD.7 19.98,16.02 23.32,19.36 v51.69,19.36 | v51.69,13.64 R6.1 51.57,12.79 D4.6
  Bottom 0.406: v51.69,40 v51.69,19.36 51.69,18.82 v51.69,13.64
IO14  (via drill 0.3)
  Top 0.254: U1.22 25.9,48.41 28.25,50.75 v28.25,53.92 | P5.12 v28.25,79.75
  Bottom 0.254: v28.25,53.92 v28.25,79.75
IO15  (via drill 0.3)
  Top 0.254: P5.18 18.68,76.75 18.41,77.01 v17.4,77.01 | U1.8 v16.43,39.13 v16.43,39.14
  Bottom 0.254: v16.43,39.14 17.4,40.1 v17.4,77.01
IO16  (via drill 0.3)
  Top 0.254: U1.9 17.88,37.93 v17.88,39.56 | P5.19 18.11,76.25 v18.01,76.35
  Bottom 0.254: v17.88,39.56 17.88,76.22 v18.01,76.35
IO17/I2C_SDA  (via drill 0.3)
  Top 0.254: v20.62,35.7 19.16,35.7 18.97,35.89 U1.10 | v13.69,22.58 R47.1 | P2.2 21.04,25 v20.73,24.69 | J2.2 v18.31,94.06
  Bottom 0.254: 20.73,35.69 v20.73,24.69 18.62,22.58 v13.69,22.58 | v20.62,35.7 20.71,35.7 20.73,35.69 | 20.73,35.69 20.73,91.64 v18.31,94.06
IO18/I2C_SCL  (via drill 0.3)
  Top 0.254: v20.12,36.5 20.12,38.18 20.02,38.28 20.02,37.98 U1.11 | P2.3 20.27,25.5 v20.12,25.35 | R42.1 arc90 R42.1 v11.18,23.29 R27.1 | J2.1 v16.31,94.08
  Bottom 0.254: 20.02,36.5 20.02,25.35 | v20.12,36.5 20.02,36.5 | 20.02,36.5 | v20.12,25.35 20.02,25.35 | 20.02,25.35 17.96,23.29 v11.18,23.29 | 20.02,36.5 20.02,90.37 v16.31,94.08
IO19  (via drill 0.3)
  Top 0.254: U1.13 22.78,36.73 23.09,36.42 v24.92,36.42 | R20.2 48.92,70.92 v48.95,70.94 49.68,71.68 54.43,71.68 v56.21,73.46
  Top 0.406: J1.1 v29.41,98.53 | v45.19,98.53 46.1,98.53 R51.1
  Bottom 0.254: v24.92,36.42 31.32,42.82 31.32,52.78 48.95,70.41 v48.95,70.94 | v56.21,73.46 56.21,87.5 v45.19,98.53
  Bottom 0.406: v29.41,98.53 v45.19,98.53
IO20  (via drill 0.3)
  Top 0.254: U1.14 27.64,37.75 v27.66,37.77 | R21.2 50.37,70.94 v50.34,70.97 50.49,71.12 54.91,71.12 v56.36,72.57
  Top 0.406: J1.2 31.41,98.75 32.31,99.64 v45.21,99.64 46.89,99.64 47.27,99.64 47.62,99.29 R53.1
  Bottom 0.254: v27.66,37.77 31.85,41.96 31.85,52.48 v50.34,70.97 | v56.36,72.57 56.97,73.18 56.97,87.88 v45.21,99.64
IO21  (via drill 0.3)
  Top 0.254: U1.23 25.8,49.67 27.64,51.51 v27.64,54.46 | P5.11 27.52,80.25 v27.64,80.37
  Bottom 0.254: v27.64,54.46 v27.64,80.37
IO38  (via drill 0.3)
  Top 0.254: U1.31 18.97,54.18 v18.59,53.8
  Top 0.406: R38.1 v15.62,25.78 R35.1
  Bottom 0.254: v15.62,25.78 17.3,25.78 18.69,27.18 18.69,53.7 v18.59,53.8
IO39  (via drill 0.3)
  Top 0.254: U1.32 17.7,55.85 v18.52,56.67 | P5.32 18.62,69.75 v18.52,69.85
  Bottom 0.254: v18.52,56.67 v18.52,69.85
IO40  (via drill 0.3)
  Top 0.254: P5.34 14.68,68.75 v14.63,68.7 | U1.33 16.43,55.96 14.89,57.5 v14.63,57.5
  Bottom 0.254: v14.63,68.7 v14.63,57.5
IO41  (via drill 0.3)
  Top 0.254: P5.33 14.8,69.25 v14.63,69.42 | U1.34 15.16,56.17 v14.63,56.7
  Bottom 0.254: v14.63,69.42 14.58,69.42 arc90 14.02,68.86 14.02,57.12 arc90 14.45,56.7 v14.63,56.7
IO42
  Top 0.254: U1.35 13.89,60.06 FB1.1
IO45  (via drill 0.3)
  Top 0.254: U1.26 25.52,53.48 25.81,53.77 v25.81,54.89 | P5.8 25.69,81.75 v25.81,81.86
  Bottom 0.254: v25.81,54.89 v25.81,81.86
IO46  (via drill 0.3)
  Top 0.254: U1.16 v26.64,40.78 v26.64,40.79 | P5.26 29.31,72.75 v29.46,72.6
  Bottom 0.254: v29.46,72.6 29.46,43.61 v26.64,40.79
IO47  (via drill 0.3)
  Top 0.254: U1.24 25.82,50.95 27.03,52.15 v27.03,53.92 | P5.10 26.9,80.75 v27.03,80.87
  Bottom 0.254: v27.03,53.92 v27.03,80.87
IO48  (via drill 0.3)
  Top 0.254: U1.25 26.08,52.22 26.42,52.55 v26.42,54.46 | P5.9 26.28,81.25 v26.42,81.38
  Bottom 0.254: v26.42,54.46 v26.42,81.38
LED+  (via drill 0.3)
  Top 0.254: v31.52,84.75 P5.2
  Top 0.61: U2.5 v41.45,49.63 | v36.85,54.28 D1.- 36.2,55.78 C12.2 36.07,55.65 C11.2 34.03,55.6 v31.52,55.6
  Bottom 0.61: v31.52,55.6 v31.52,84.75 | v36.85,54.28 36.85,54.23 v41.45,49.63
LED-  (via drill 0.3)
  Top 0.254: P5.1 30.54,85.25 v30.68,85.39
  Top 0.61: v30.68,50 33.31,47.37 R32.2 R33.2 36.61,47.37 U2.3
  Bottom 0.254: v30.68,50 v30.68,85.39
N$1
  Top 0.254: IC1.16 47.6,50.75 C4.2
N$2
  Top 0.254: Q4.1 48.56,48.63 R26.1
N$3
  Top 0.254: Q3.1 48.43,45.32 R25.1
N$6
  Top 0.254: USB-NATIVE.A5 56.46,67.79 55.02,66.34 R15.2
N$7
  Top 0.254: PWR.C 55.34,12.27 R19.2
N$10
  Top 0.254: USB-TTL.A5 R13.2
N$11
  Top 0.254: USB-TTL.B5 53.41,59.12 R12.2
N$12  (1 unrouted)
  Top 0.254: IC1.7 45.06,55.54 R11.1 | 45.26,55.24 45.01,55.24 44.78,55.47 44.78,58.85 45.34,58.85 45.34,55.83 45.62,55.55 45.62,55.24 45.26,55.24 | 45.26,55.24 44.96,55.55 44.96,58.19 45.19,58.19 45.19,55.68 45.47,55.4
  Top 0.813: R11.1 45.06,60.05 R10.1
N$14
  Top 0.254: USB-NATIVE.B5 56.72,70.79 54.61,68.68 R14.2
N$17  (1 unrouted)
  Top 0.61: 37.92,51.92 U2.1 37.91,50.57 R23.2 | 37.92,51.92 37.92,54.17 L1.P$2 | D1.+ 37.89,51.89 37.92,51.92 | 36.04,50.52 36.02,50.55 36.02,52.12 37.34,52.12 37.9,52.68 38.71,52.68 38.71,50.85 38.43,50.57 37.03,50.57 36.37,51.23 36.6,51.46 38.25,51.46 38.28,51.49 38.28,52.38 38.25,52.35 38.25,51 36.65,51
N$18  (via drill 0.3)
  Top 0.254: v41.2,45.41 40.54,45.41 R29.2 | IC1.21 50.09,53.75 v50.24,53.9
  Bottom 0.254: v50.24,53.9 50.24,46.86 48.79,45.41 v41.2,45.41
N$19  (via drill 0.3)
  Top 0.254: R30.2 v41.67,42.33 v41.68,42.34 | IC1.20 v51.51,53.25
  Bottom 0.254: v41.68,42.34 47.7,42.34 51.51,46.15 v51.51,53.25
N$21
  Top 0.254: IC2.P$9 50.56,92.8 R41.1
N$22
  Top 0.406: C2.2 R23.1
N$23
  Top 0.254: IC2.P$10 49.81,93.3 50.19,93.67 50.19,94.59 50.47,94.87 R43.1
N$24
  Top 0.61: Q7.3 R39.1 43.09,48.68 U2.4 40.51,48.18 | R31.2 40.51,48.18 | 40.51,48.18 43.26,48.18 43.26,47.6 40.69,47.6 40.69,47.09 43.1,47.09
N$26
  Top 0.61: R41.2 52.83,93.55 54.03,93.55 C33.2 55.65,93.67 59.81,89.52 SPK.1
N$27
  Top 0.61: R43.2 52.96,95.17 C34.2 54.18,95.2 55.6,95.2 60.03,90.77 SPK.2
N$28  (via drill 0.3)
  Top 0.254: v14.61,81 14.61,82.04 R3.1 | P5.31 19.06,70.25 18.8,70.51 v14.62,70.51 v14.61,70.5
  Bottom 0.254: v14.61,70.5 v14.61,81
N$29
  Top 0.61: R59.1 R60.2 42.34,45.3 Q7.1
N$30
  Top 0.406: U6.2 44.88,65.86 R28.1
N$31
  Top 0.406: U6.7 44.88,74.14 R61.2
N$32
  Top 0.406: U6.6 46.15,73.91 44.65,75.41 44.65,76.25 43.51,77.39 R62.2
N$33
  Top 0.406: CHRG.C 41.76,74.02 R61.1
N$34
  Top 0.406: DONE.C 40.39,76.07 R62.1
N$47
  Top 0.406: SD.1 28.97,12.68 R7.1
N$48
  Top 0.406: SD.8 18.88,12.97 20.7,11.15 40.59,11.15 R9.1
N$76
  Top 0.406: U5.4 42.39,81.77 C45.1
RESET  (via drill 0.3)
  Top 0.254: v27.64,46.99 28.57,46.99 33.83,41.73 v35.05,41.73 | U1.3 10.08,46.15 11.61,47.68 21.46,47.68 22.25,46.89 v23.37,46.89 | Q4.3 v53.09,47.68 63.14,47.68 RST.2
  Top 0.406: U1.3 10.08,29.9 R16.1 11.99,29.67 C8.1 13.74,29.59 R34.1
  Bottom 0.254: v27.64,46.99 23.47,46.99 v23.37,46.89 | v35.05,41.73 48.08,41.73 53.09,46.74 v53.09,47.68
RST
  Top 0.254: P2.5 17.16,26.5 R35.2
  Top 0.406: R34.2 R44.1 16.94,28.01 C13.2 17.14,27.81 R35.2
RTS  (via drill 0.3)
  Top 0.254: R25.2 48.42,46.73 v49.15,46.73 Q4.2 | IC1.19 v49.35,50.06
  Bottom 0.254: v49.35,50.06 49.35,46.93 v49.15,46.73
RXD/IO44  (via drill 0.3)
  Top 0.254: U1.36 12.62,52.05 15.85,48.82 22.15,48.82 22.58,48.39 v23.34,48.39 | v27.51,48.39 28.93,48.39 33.45,43.87 R59.2 39,43.88 R29.1
  Bottom 0.254: v23.34,48.39 v27.51,48.39
TP_INT
  Top 0.254: P2.4 19.5,26 R37.1
  Top 0.406: R36.1 R38.2 17.75,25.6 R37.1
TXD/IO43  (via drill 0.3)
  Top 0.254: U1.37 11.35,52.27 15.39,48.23 21.79,48.23 22.4,47.62 v23.37,47.62 | v27.13,47.62 28.93,47.62 34.23,42.33 R30.1
  Bottom 0.254: v23.37,47.62 v27.13,47.62
USB_D+
  Top 0.254: USB-NATIVE.A6 62.01,68.79 62.23,69.01 62.23,69.49 61.95,69.77 61.03,69.77 USB-NATIVE.B6 56.6,69.79 54.59,67.77 51.31,67.77 R21.1
USB_D-
  Top 0.254: USB-NATIVE.B7 59.77,68.29 | R20.1 50.37,67.26 54.91,67.26 55.94,68.29 59.77,68.29 | USB-NATIVE.A7 60.02,69.29 59.79,69.06 59.79,68.56 | 59.79,68.56 59.79,68.31 59.77,68.29 | 59.79,68.56 59.54,68.3 60.1,68.3 59.82,68.58
VBAT
  Top 0.61: BAT.+ 53.97,80.05 49.58,75.67 49.15,75.67 | 49.15,75.67 48.14,75.67 Q6.3 48.08,75.66 47.6,75.66 | C40.1 49.05,75.56 49.15,75.67 | D11.+ 47.6,75.66 | U6.5 47.42,75.48 47.6,75.66
  pour Top: 60.1,80.75 53.77,80.75 49.5,76.48 45.47,76.48 45.47,75.46 46.84,74.09 46.84,72.8 47.85,72.8 54.23,79.17 60.02,79.17 60.1,79.17
VBUS  (via drill 0.3)
  Top 0.254: IC1.8 C6.2
  Top 0.61: USB-TTL.VBUS2 v59.87,59.82 52.78,59.82 | USB-TTL.VBUS1 59.9,54.92 v59.87,54.89 | C6.2 43.54,55.19 R11.2 v43.54,59.36 | 52.78,59.82 52.68,59.92 D5.A 52.44,60.17 C7.2 | 52.78,59.82 50.55,59.82 v50.09,59.36
  Bottom 0.61: v59.87,54.89 v59.87,59.82 | v43.54,59.36 v50.09,59.36
VDD
  Top 0.254: IC2.P$7 IC2.P$8 48.53,90.36 C26.2 C28.2 C27.2 R55.2 48.49,84.81 R48.1 45.26,84.18 R56.2 44.77,84.6 R46.1
  pour Top: 47.88,92.46 47.88,85.09 47.57,84.79 46.23,84.79 45.52,85.5 42.82,85.5 42.82,83.77 45.62,83.77 45.8,83.59 49,83.59 49,92.46
VPWR  (via drill 0.3)
  Top 0.254: D3.C 40.97,63.3
  Top 0.61: U2.6 42.04,50.58 | 42.04,50.58 43.09,50.58 R39.2 | L1.P$1 42.01,50.61 42.04,50.58 | 40.97,58.9 40.87,58.8 40.87,51.61 40.21,50.95 40.21,50.6 42.65,50.6 43.03,50.22 43.71,50.22 43.71,50.67 42.42,51.97 42.42,57.12 41.12,58.42 41.12,57.86 41.33,57.66 41.33,51.54 40.77,50.98 42.95,50.98 | 42.95,50.98 42.98,50.95 | 42.95,50.98 42.39,51.54 41.58,51.54 41.58,52.86 41.63,52.91
  Top 0.813: v40.97,66.32 40.97,63.3 40.97,58.9 40.97,58.42 42.01,57.38 L1.P$1
  Bottom 0.813: v40.97,66.32 40.97,76.33 42.42,77.78 v45.03,77.78
  pour Top: 44.75,79.58 44.75,77.75 45.14,77.37 47.75,77.37 47.75,78.18 47.32,78.18 47.07,78.44 47.07,80.04 47.5,80.47 48.34,80.47 48.34,83.08 45.8,83.08 45.8,82.35 44.93,81.48 44.93,80.95 46.35,80.95 46.48,80.82 46.48,79.81 46.28,79.6 46.25,79.58

### Text on the board
tPlace: IO18/SCL | IO17/SDA | +3V3 | GND | IO19/D- | IO20/D+ | +3V3 | GND | - | + | - | + | ESP32-S3 Parallel TFT | with Touch 4.3" V3.1 | www.makerfabs.com